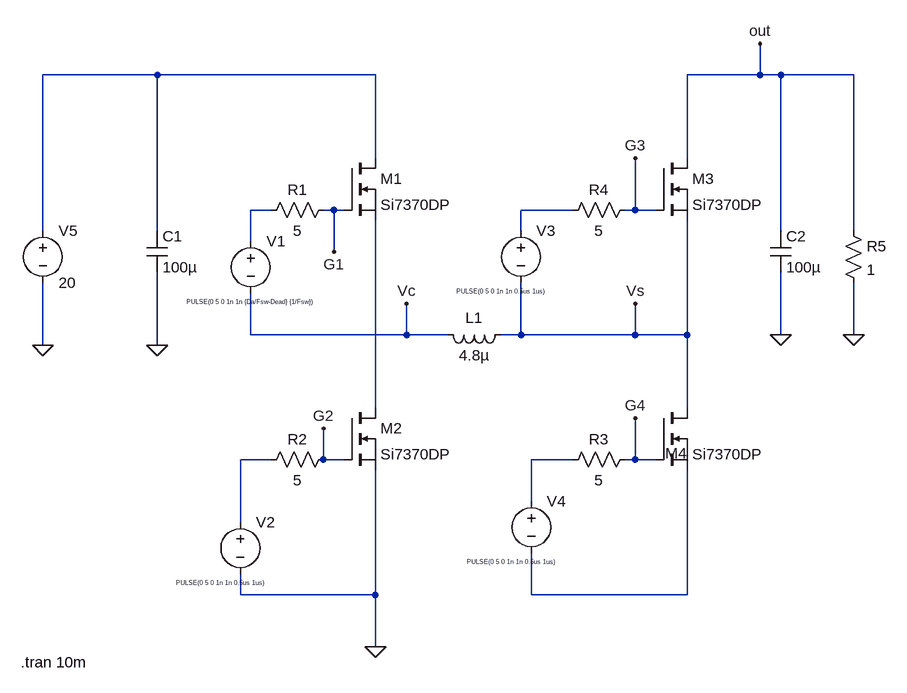
[diagram p0: schematic buck_boost.asc]
buck_boost.asc, the LTspice schematic file:
Version 4
SHEET 1 1748 680
WIRE 16 -288 -160 -288
WIRE 352 -288 16 -288
WIRE 944 -288 944 -336
WIRE 944 -288 832 -288
WIRE 976 -288 944 -288
WIRE 1088 -288 976 -288
WIRE 352 -160 352 -288
WIRE 832 -160 832 -288
WIRE 192 -80 160 -80
WIRE 288 -80 272 -80
WIRE 304 -80 288 -80
WIRE 656 -80 576 -80
WIRE 752 -80 752 -160
WIRE 752 -80 736 -80
WIRE 784 -80 752 -80
WIRE -160 -48 -160 -288
WIRE 16 -48 16 -288
WIRE 576 -48 576 -80
WIRE 976 -48 976 -288
WIRE 1088 -48 1088 -288
WIRE 160 -32 160 -80
WIRE 288 -16 288 -80
WIRE 160 112 160 48
WIRE 400 112 400 64
WIRE 400 112 160 112
WIRE 464 112 400 112
WIRE 576 112 576 32
WIRE 576 112 544 112
WIRE 752 112 752 64
WIRE 752 112 576 112
WIRE 832 112 832 -64
WIRE 832 112 752 112
WIRE 976 112 976 16
WIRE 1088 112 1088 32
WIRE -160 128 -160 32
WIRE 16 128 16 16
WIRE 352 224 352 -64
WIRE 832 224 832 112
WIRE 192 304 144 304
WIRE 272 304 272 256
WIRE 304 304 272 304
WIRE 656 304 592 304
WIRE 752 304 752 240
WIRE 752 304 736 304
WIRE 784 304 752 304
WIRE 592 368 592 304
WIRE 144 400 144 304
WIRE 144 512 144 480
WIRE 352 512 352 320
WIRE 352 512 144 512
WIRE 592 512 592 448
WIRE 832 512 832 320
WIRE 832 512 592 512
WIRE 352 592 352 512
FLAG 352 592 0
FLAG -160 128 0
FLAG 16 128 0
FLAG 976 112 0
FLAG 1088 112 0
FLAG 288 -16 G1
FLAG 272 256 G2
FLAG 752 240 G4
FLAG 752 -160 G3
FLAG 944 -336 out
FLAG 400 64 Vc
FLAG 752 64 Vs
SYMBOL voltage 160 -48 R0
WINDOW 3 -99 109 Left 0
WINDOW 123 0 0 Left 0
WINDOW 39 0 0 Left 0
SYMATTR Value PULSE(0 5 0 1n 1n {Da/Fsw-Dead} {1/Fsw})
SYMATTR InstName V1
SYMBOL nmos 304 -160 R0
SYMATTR InstName M1
SYMATTR Value Si7370DP
SYMBOL ind 560 96 R90
WINDOW 0 5 56 VBottom 2
WINDOW 3 32 56 VTop 2
SYMATTR InstName L1
SYMATTR Value 4.8µ
SYMBOL nmos 304 224 R0
SYMATTR InstName M2
SYMATTR Value Si7370DP
SYMBOL nmos 784 -160 R0
SYMATTR InstName M3
SYMATTR Value Si7370DP
SYMBOL nmos 784 224 R0
WINDOW 0 14 70 Left 2
SYMATTR InstName M4
SYMATTR Value Si7370DP
SYMBOL voltage 592 352 R0
WINDOW 3 -99 109 Left 0
WINDOW 123 0 0 Left 0
WINDOW 39 0 0 Left 0
SYMATTR Value PULSE(0 5 0 1n 1n 0.5us 1us)
SYMATTR InstName V4
SYMBOL res 288 -96 R90
WINDOW 0 0 56 VBottom 2
WINDOW 3 32 56 VTop 2
SYMATTR InstName R1
SYMATTR Value 5
SYMBOL res 288 288 R90
WINDOW 0 0 56 VBottom 2
WINDOW 3 32 56 VTop 2
SYMATTR InstName R2
SYMATTR Value 5
SYMBOL res 752 288 R90
WINDOW 0 0 56 VBottom 2
WINDOW 3 32 56 VTop 2
SYMATTR InstName R3
SYMATTR Value 5
SYMBOL res 752 -96 R90
WINDOW 0 0 56 VBottom 2
WINDOW 3 32 56 VTop 2
SYMATTR InstName R4
SYMATTR Value 5
SYMBOL voltage -160 -64 R0
WINDOW 123 0 0 Left 0
WINDOW 39 0 0 Left 0
SYMATTR InstName V5
SYMATTR Value 20
SYMBOL cap 0 -48 R0
SYMATTR InstName C1
SYMATTR Value 100µ
SYMBOL cap 960 -48 R0
SYMATTR InstName C2
SYMATTR Value 100µ
SYMBOL res 1072 -64 R0
SYMATTR InstName R5
SYMATTR Value 1
SYMBOL voltage 576 -64 R0
WINDOW 3 -99 109 Left 0
WINDOW 123 0 0 Left 0
WINDOW 39 0 0 Left 0
SYMATTR Value PULSE(0 5 0 1n 1n 0.5us 1us)
SYMATTR InstName V3
SYMBOL voltage 144 384 R0
WINDOW 3 -99 109 Left 0
WINDOW 123 0 0 Left 0
WINDOW 39 0 0 Left 0
SYMATTR Value PULSE(0 5 0 1n 1n 0.5us 1us)
SYMATTR InstName V2
TEXT -194 616 Left 2 !.tran 10m

The netlist it stands for:
* buck_boost.asc
V1 N002 Vc PULSE(0 5 0 1n 1n {Da/Fsw-Dead} {1/Fsw})
M1 N001 G1 N004 N004 Si7370DP
L1 Vs Vc 4.8µ
M2 N004 G2 0 0 Si7370DP
M3 out G3 Vs Vs Si7370DP
M4 Vs G4 N007 N007 Si7370DP
V4 N006 N007 PULSE(0 5 0 1n 1n 0.5us 1us)
R1 G1 N002 5
R2 G2 N005 5
R3 G4 N006 5
R4 G3 N003 5
V5 N001 0 20
C1 N001 0 100µ
C2 out 0 100µ
R5 out 0 1
V3 N003 Vs PULSE(0 5 0 1n 1n 0.5us 1us)
V2 N005 0 PULSE(0 5 0 1n 1n 0.5us 1us)
.model NMOS NMOS
.model PMOS PMOS
.lib standard.mos
.tran 10m
.backanno
.end